# Altium schematic sheet 0246_GPU DECOUPLING_ VC.SchDoc
size 848 x 558 mm
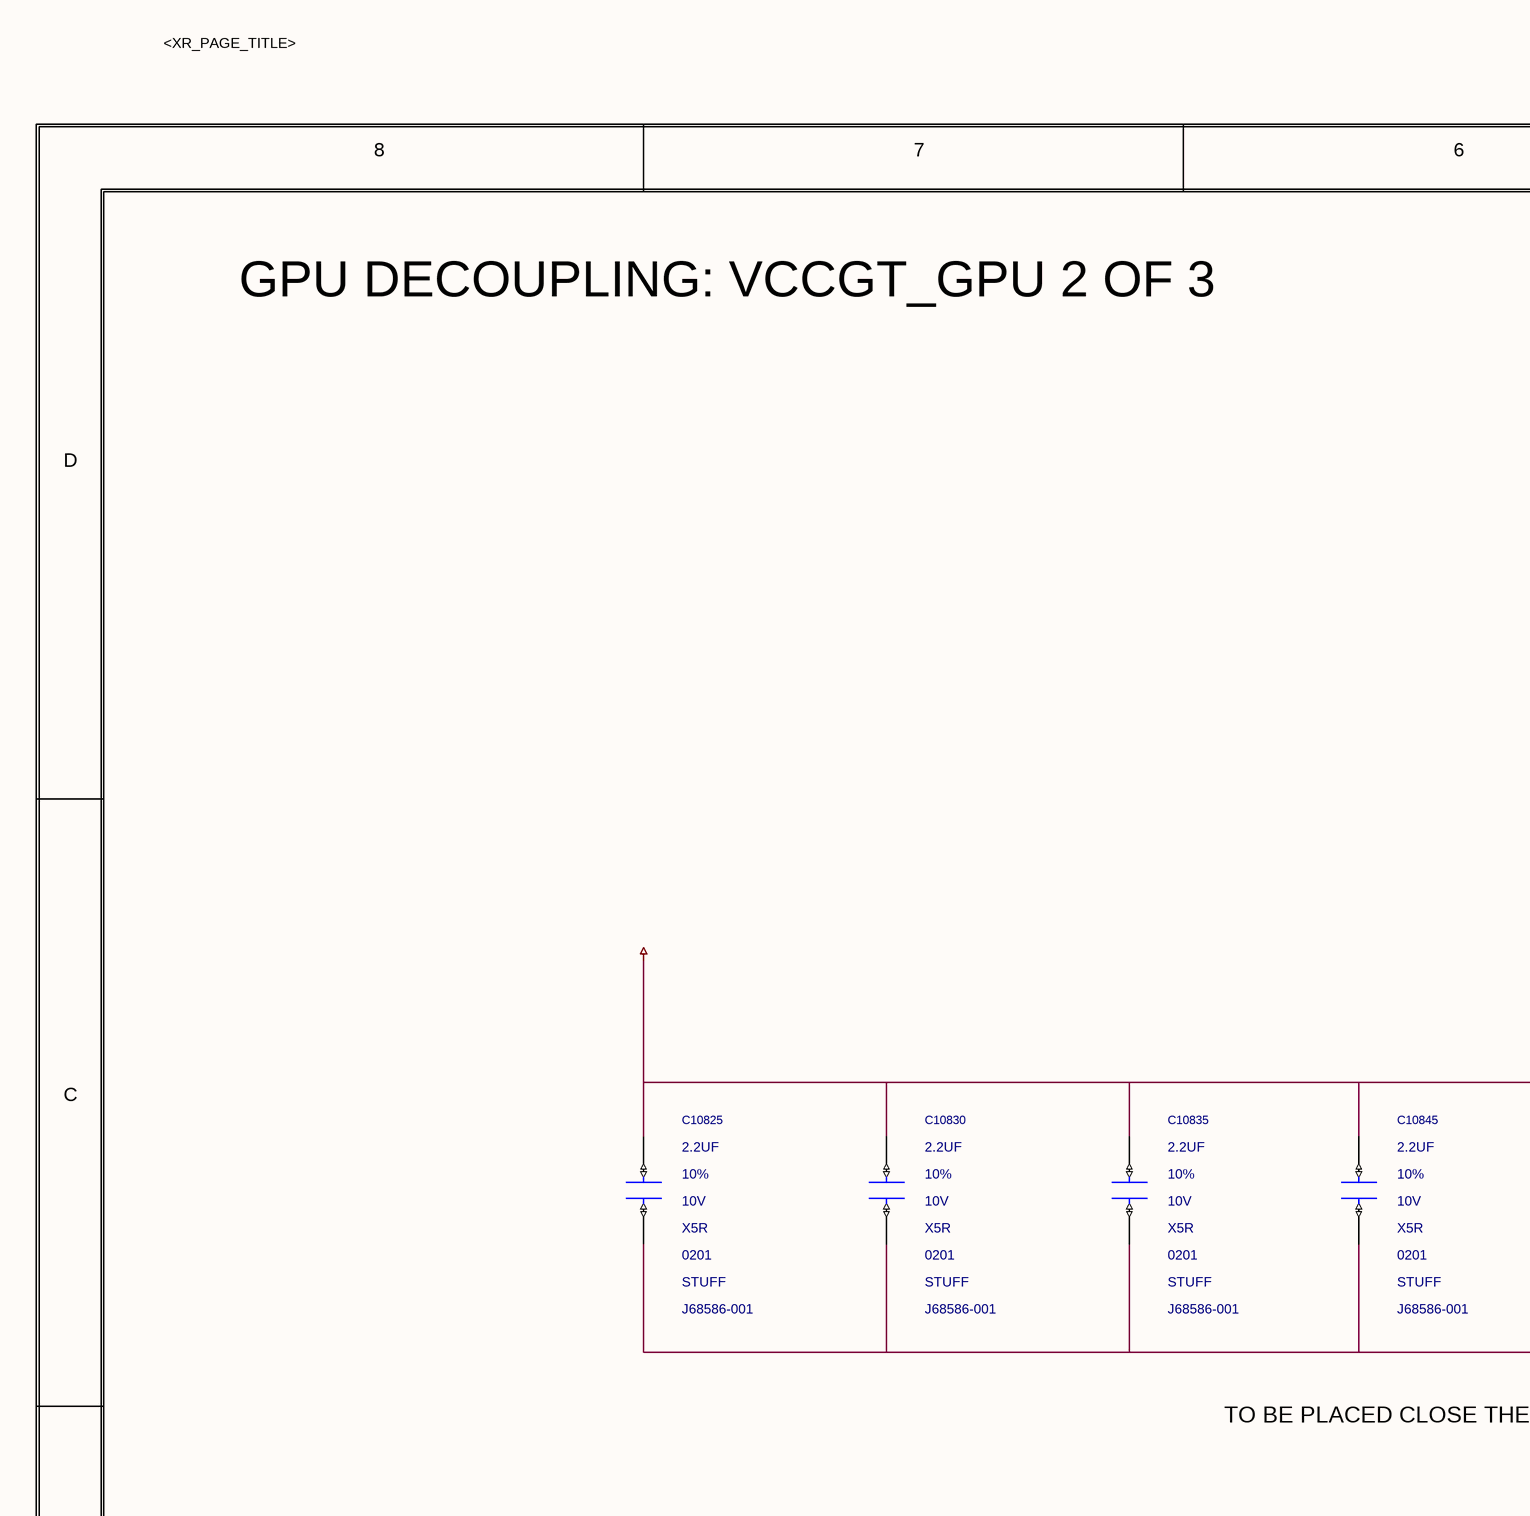
[diagram p0: 0246_GPU DECOUPLING_ VC.SchDoc, top left]
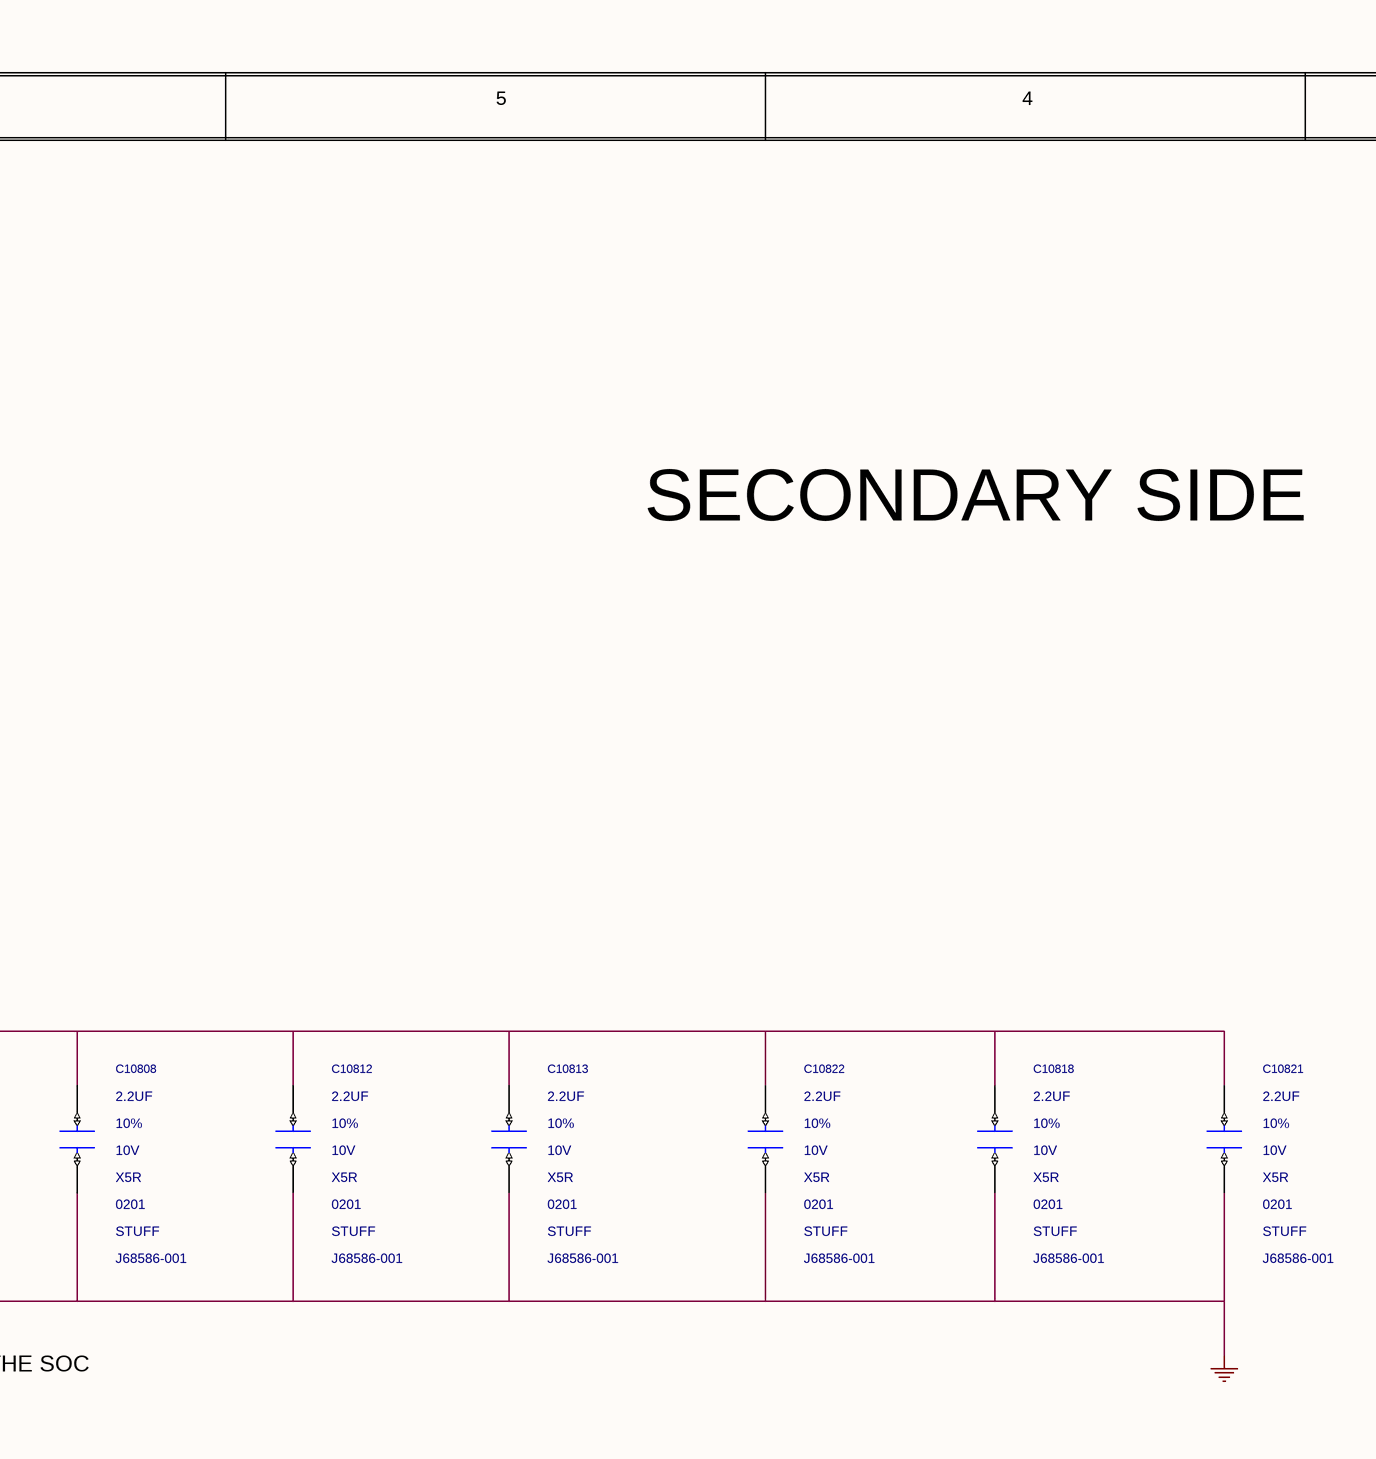
[diagram p1: 0246_GPU DECOUPLING_ VC.SchDoc, top middle]
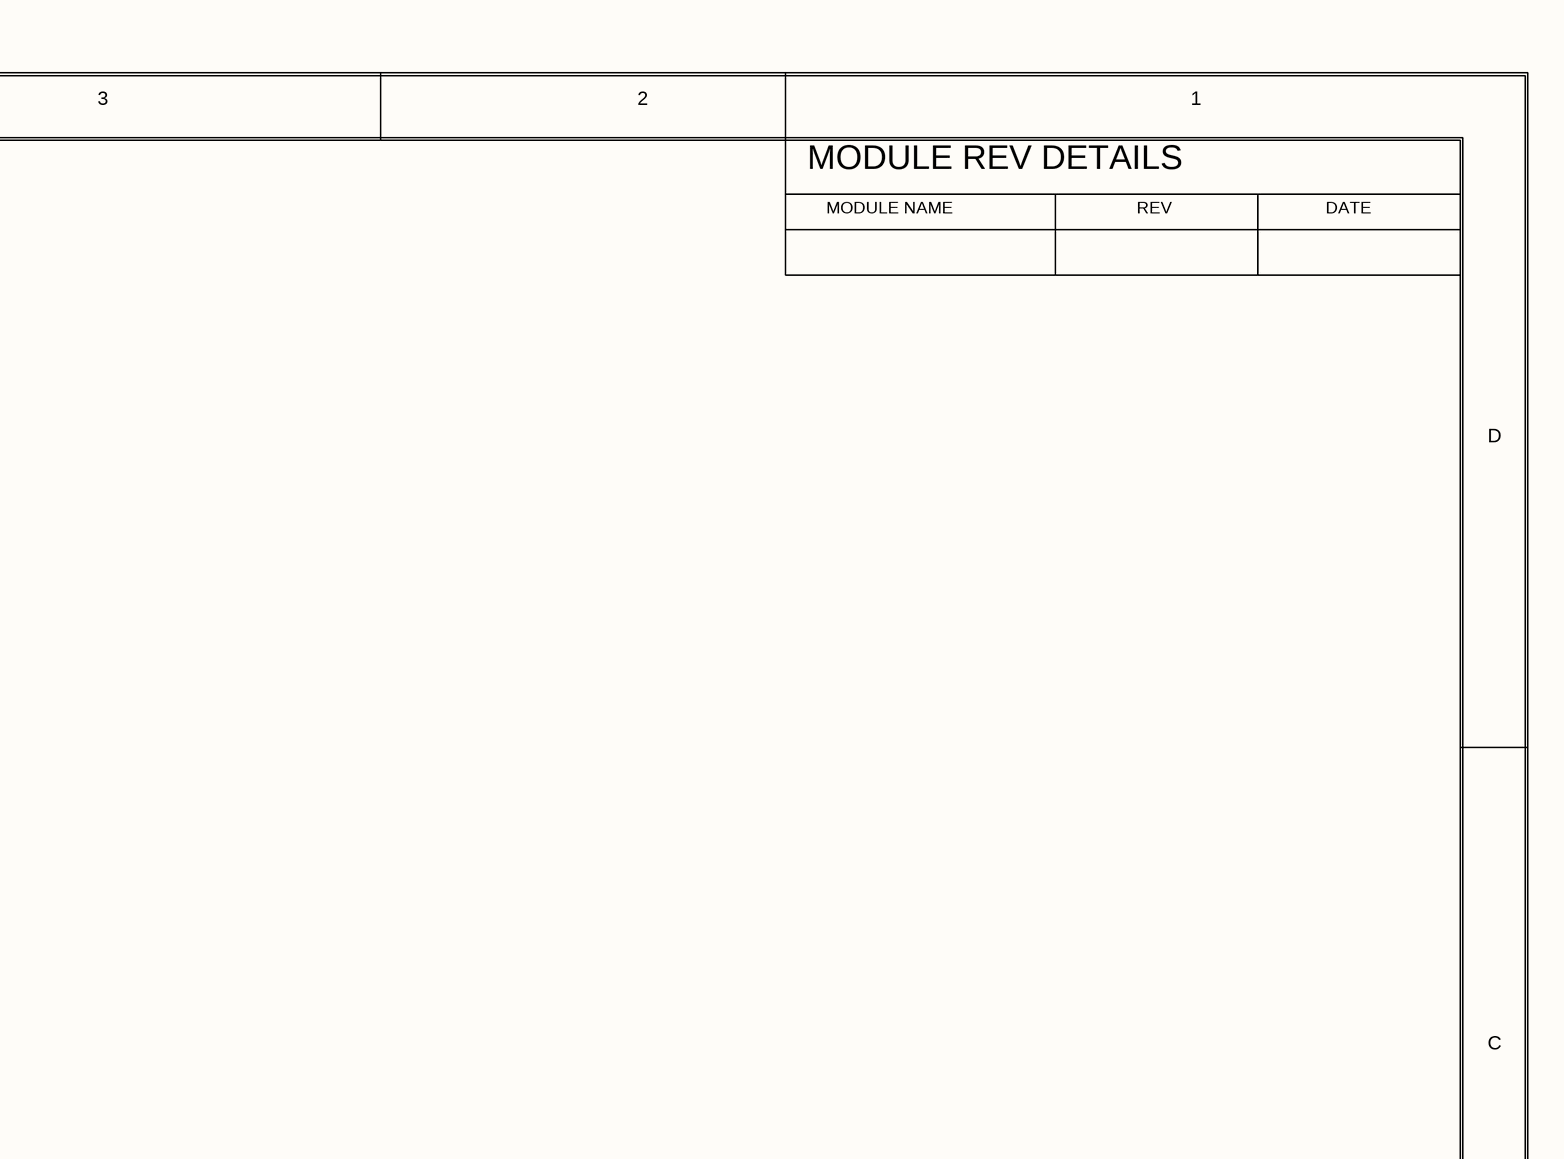
[diagram p2: 0246_GPU DECOUPLING_ VC.SchDoc, top right]
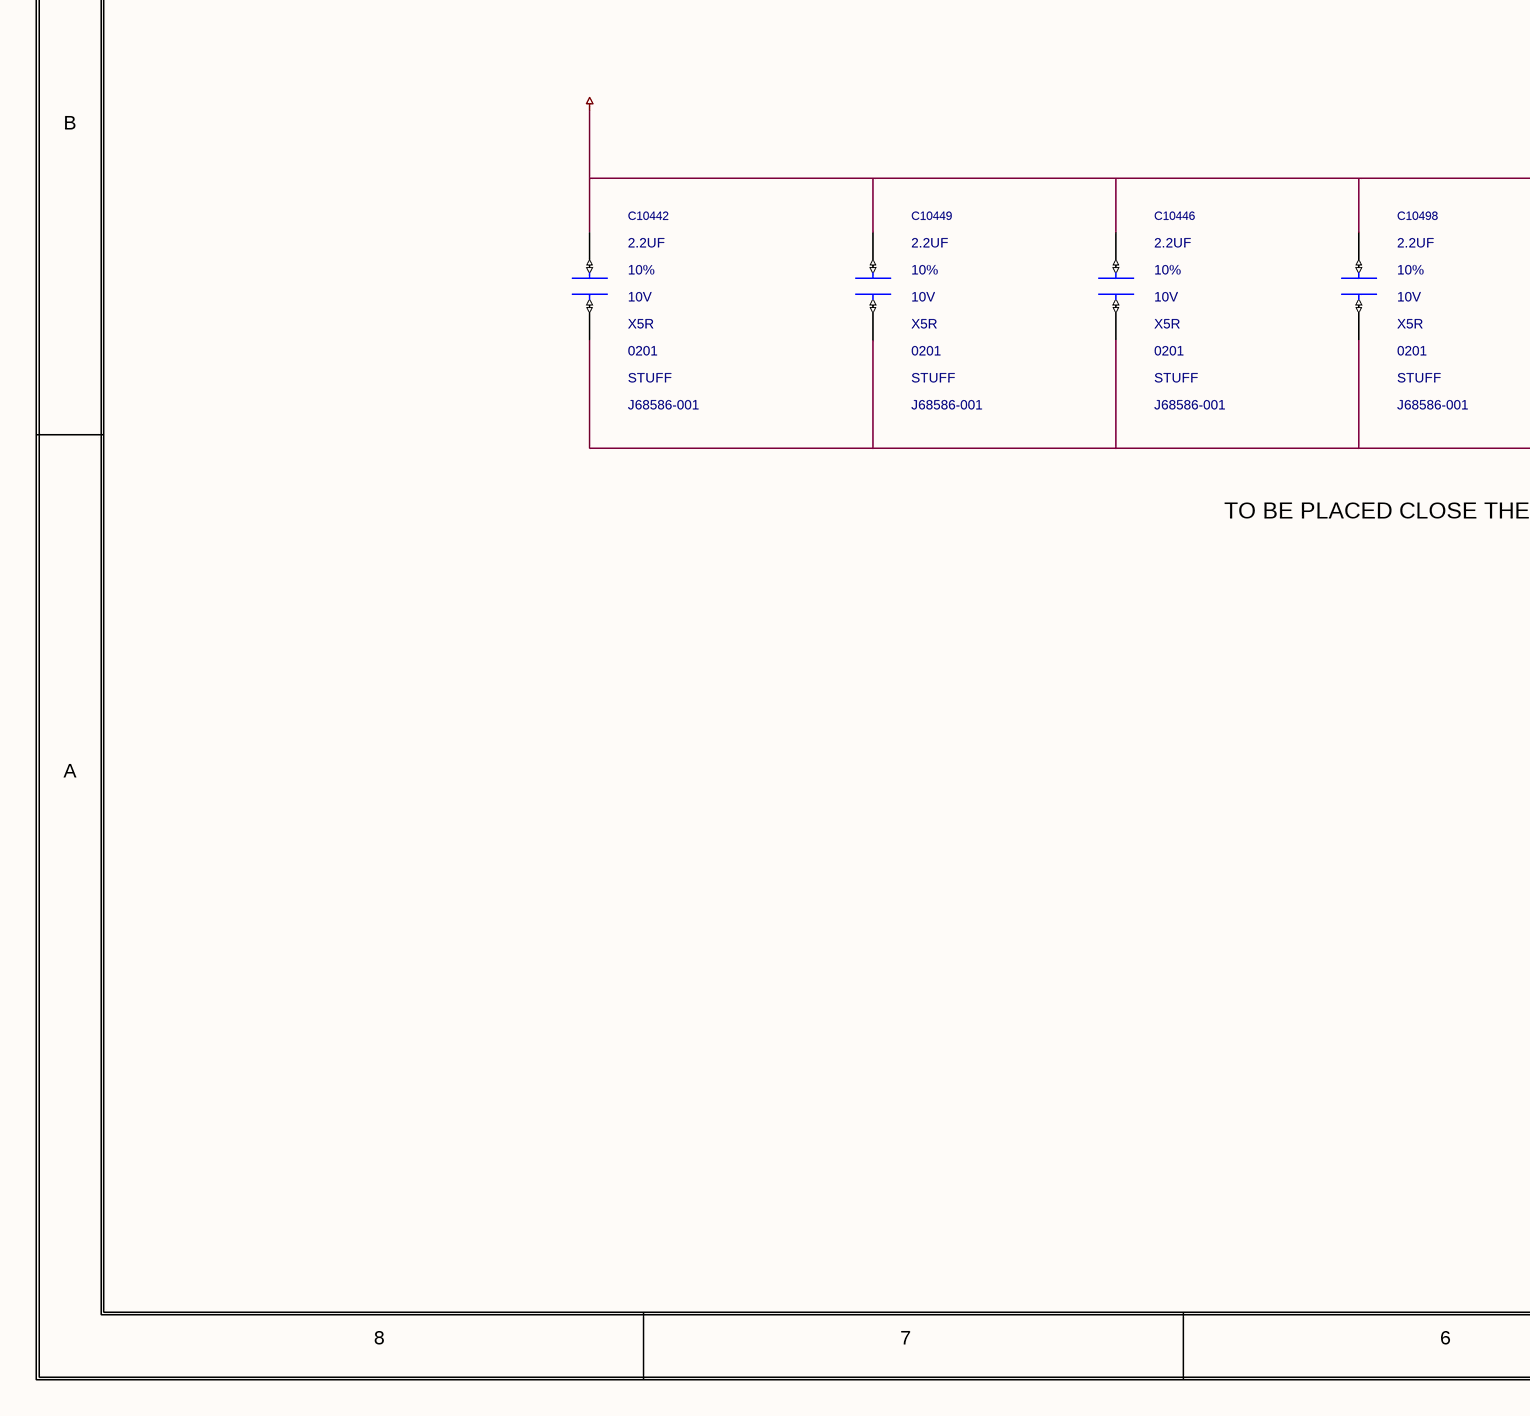
[diagram p3: 0246_GPU DECOUPLING_ VC.SchDoc, bottom left]
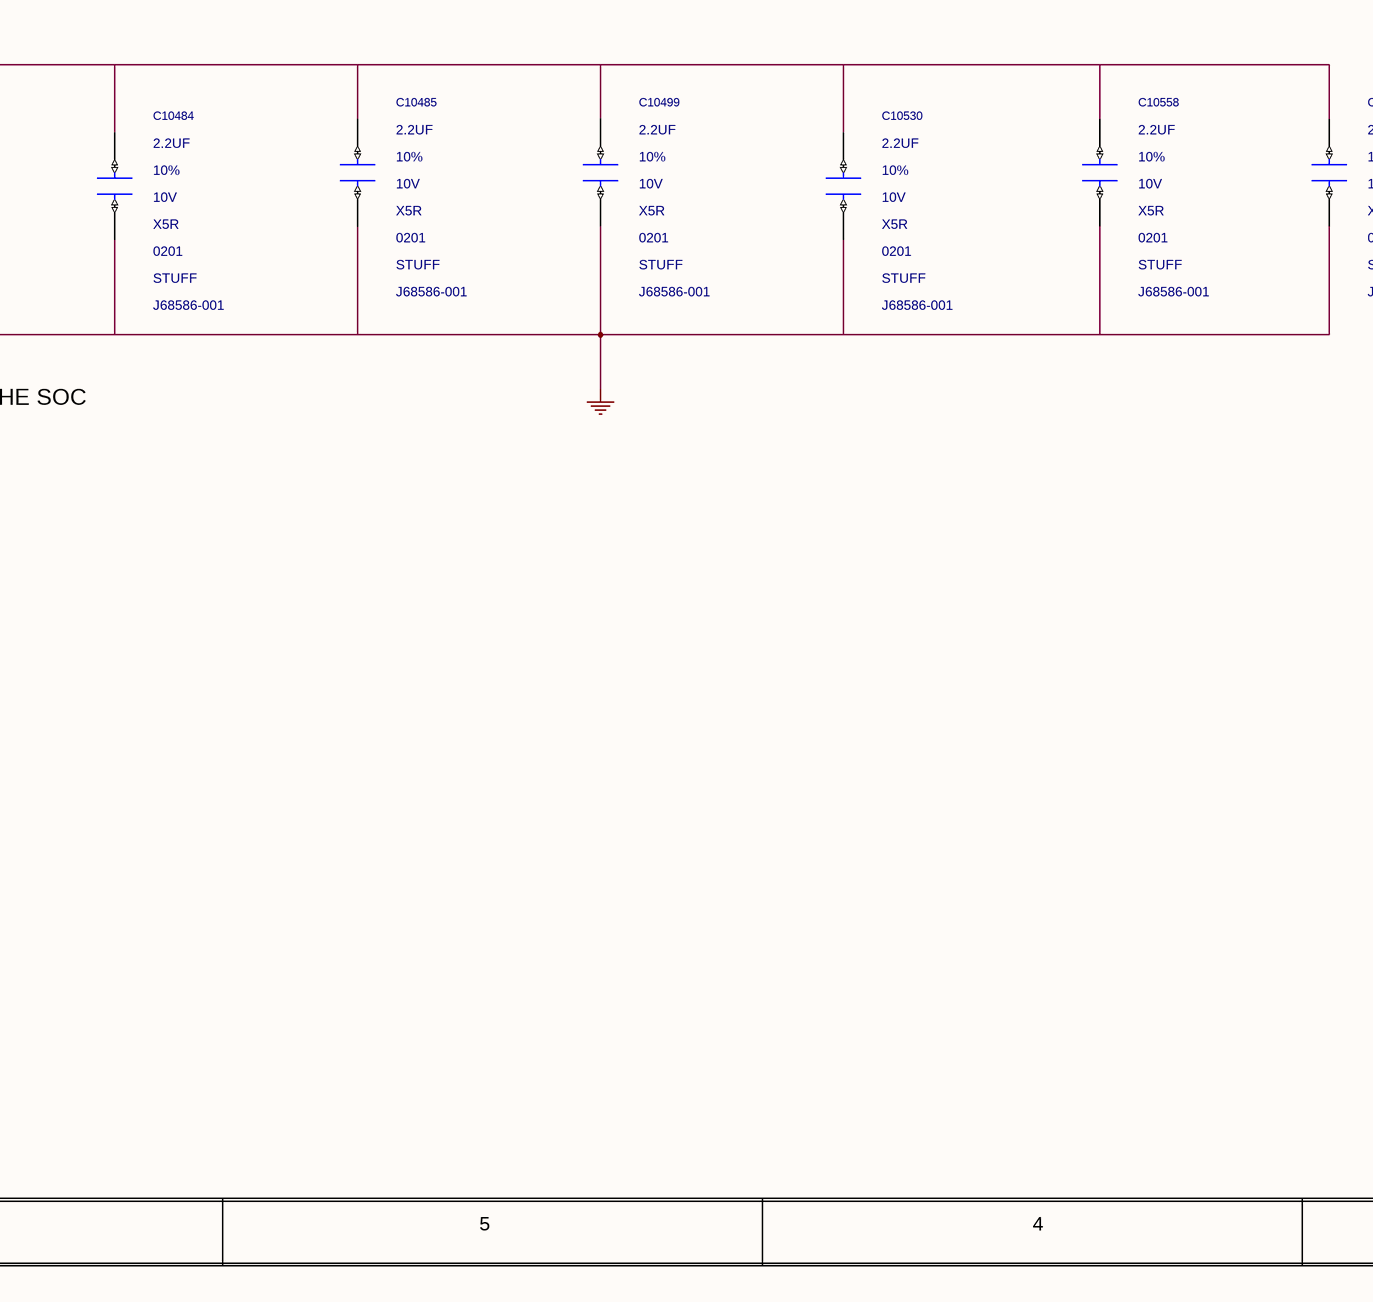
[diagram p4: 0246_GPU DECOUPLING_ VC.SchDoc, bottom middle]
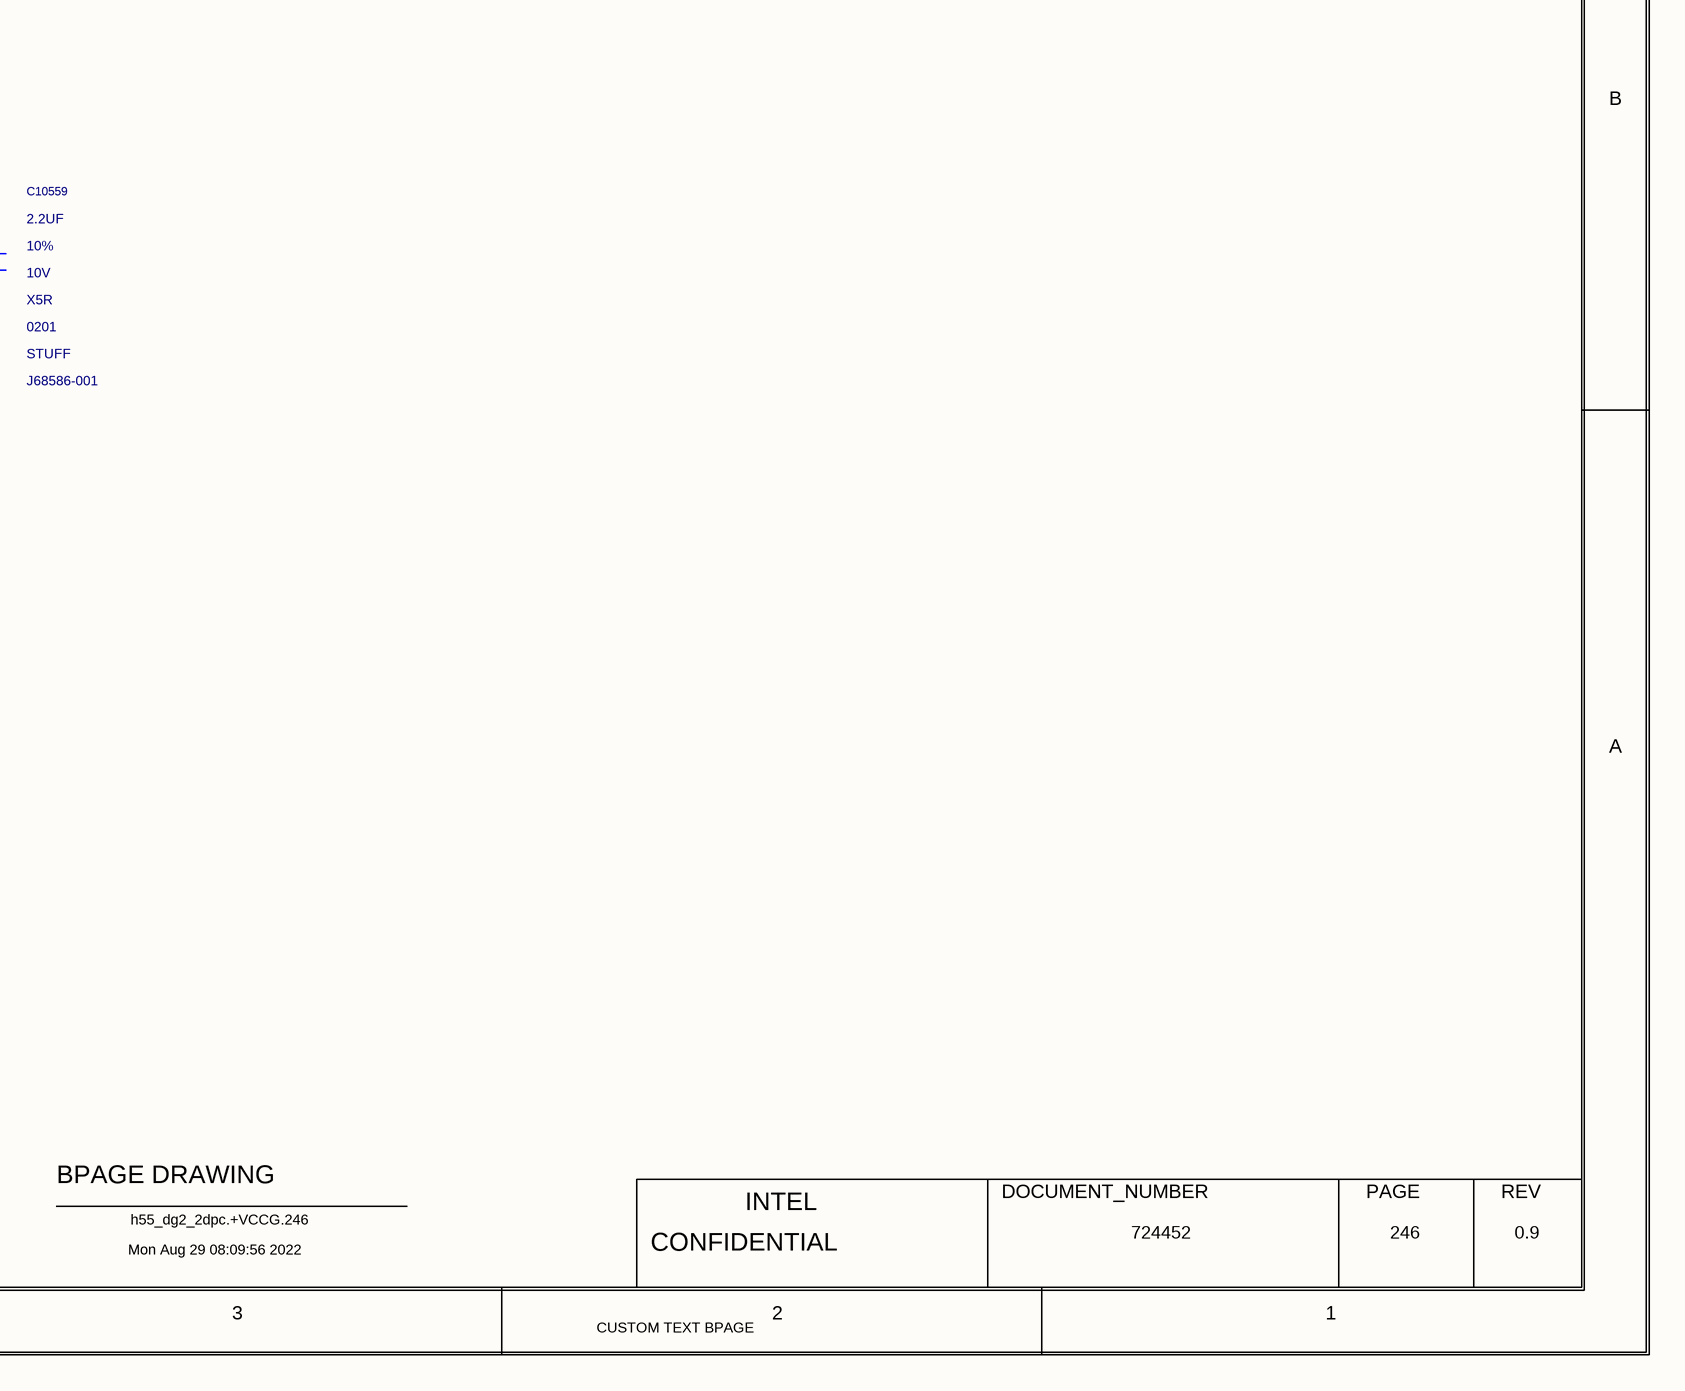
[diagram p5: 0246_GPU DECOUPLING_ VC.SchDoc, bottom right]

## Parts
C10442  2.2UF  BOM_USE: STUFF  MATERIAL: X5R  PACK_TYPE: 0201  PART_NUMBER: J68586-001  TOLERANCE: 10%  VOLTAGE: 10V  [TK0_SM0201_690X390_MC]
C10446  2.2UF  BOM_USE: STUFF  MATERIAL: X5R  PACK_TYPE: 0201  PART_NUMBER: J68586-001  TOLERANCE: 10%  VOLTAGE: 10V  [TK0_SM0201_690X390_MC]
C10449  2.2UF  BOM_USE: STUFF  MATERIAL: X5R  PACK_TYPE: 0201  PART_NUMBER: J68586-001  TOLERANCE: 10%  VOLTAGE: 10V  [TK0_SM0201_690X390_MC]
C10484  2.2UF  BOM_USE: STUFF  MATERIAL: X5R  PACK_TYPE: 0201  PART_NUMBER: J68586-001  TOLERANCE: 10%  VOLTAGE: 10V  [TK0_SM0201_690X390_MC]
C10485  2.2UF  BOM_USE: STUFF  MATERIAL: X5R  PACK_TYPE: 0201  PART_NUMBER: J68586-001  TOLERANCE: 10%  VOLTAGE: 10V  [TK0_SM0201_690X390_MC]
C10498  2.2UF  BOM_USE: STUFF  MATERIAL: X5R  PACK_TYPE: 0201  PART_NUMBER: J68586-001  TOLERANCE: 10%  VOLTAGE: 10V  [TK0_SM0201_690X390_MC]
C10499  2.2UF  BOM_USE: STUFF  MATERIAL: X5R  PACK_TYPE: 0201  PART_NUMBER: J68586-001  TOLERANCE: 10%  VOLTAGE: 10V  [TK0_SM0201_690X390_MC]
C10530  2.2UF  BOM_USE: STUFF  MATERIAL: X5R  PACK_TYPE: 0201  PART_NUMBER: J68586-001  TOLERANCE: 10%  VOLTAGE: 10V  [TK0_SM0201_690X390_MC]
C10558  2.2UF  BOM_USE: STUFF  MATERIAL: X5R  PACK_TYPE: 0201  PART_NUMBER: J68586-001  TOLERANCE: 10%  VOLTAGE: 10V  [TK0_SM0201_690X390_MC]
C10559  2.2UF  BOM_USE: STUFF  MATERIAL: X5R  PACK_TYPE: 0201  PART_NUMBER: J68586-001  TOLERANCE: 10%  VOLTAGE: 10V  [TK0_SM0201_690X390_MC]
C10808  2.2UF  BOM_USE: STUFF  MATERIAL: X5R  PACK_TYPE: 0201  PART_NUMBER: J68586-001  TOLERANCE: 10%  VOLTAGE: 10V  [TK0_SM0201_690X390_MC]
C10812  2.2UF  BOM_USE: STUFF  MATERIAL: X5R  PACK_TYPE: 0201  PART_NUMBER: J68586-001  TOLERANCE: 10%  VOLTAGE: 10V  [TK0_SM0201_690X390_MC]
C10813  2.2UF  BOM_USE: STUFF  MATERIAL: X5R  PACK_TYPE: 0201  PART_NUMBER: J68586-001  TOLERANCE: 10%  VOLTAGE: 10V  [TK0_SM0201_690X390_MC]
C10818  2.2UF  BOM_USE: STUFF  MATERIAL: X5R  PACK_TYPE: 0201  PART_NUMBER: J68586-001  TOLERANCE: 10%  VOLTAGE: 10V  [TK0_SM0201_690X390_MC]
C10821  2.2UF  BOM_USE: STUFF  MATERIAL: X5R  PACK_TYPE: 0201  PART_NUMBER: J68586-001  TOLERANCE: 10%  VOLTAGE: 10V  [TK0_SM0201_690X390_MC]
C10822  2.2UF  BOM_USE: STUFF  MATERIAL: X5R  PACK_TYPE: 0201  PART_NUMBER: J68586-001  TOLERANCE: 10%  VOLTAGE: 10V  [TK0_SM0201_690X390_MC]
C10825  2.2UF  BOM_USE: STUFF  MATERIAL: X5R  PACK_TYPE: 0201  PART_NUMBER: J68586-001  TOLERANCE: 10%  VOLTAGE: 10V  [TK0_SM0201_690X390_MC]
C10830  2.2UF  BOM_USE: STUFF  MATERIAL: X5R  PACK_TYPE: 0201  PART_NUMBER: J68586-001  TOLERANCE: 10%  VOLTAGE: 10V  [TK0_SM0201_690X390_MC]
C10835  2.2UF  BOM_USE: STUFF  MATERIAL: X5R  PACK_TYPE: 0201  PART_NUMBER: J68586-001  TOLERANCE: 10%  VOLTAGE: 10V  [TK0_SM0201_690X390_MC]
C10845  2.2UF  BOM_USE: STUFF  MATERIAL: X5R  PACK_TYPE: 0201  PART_NUMBER: J68586-001  TOLERANCE: 10%  VOLTAGE: 10V  [TK0_SM0201_690X390_MC]

## Nets
+VCCGT_GPU: C10442.1(A) C10446.1(A) C10449.1(A) C10484.1(A) C10485.1(A) C10498.1(A) C10499.1(A) C10530.1(A) C10558.1(A) C10559.1(A) C10808.1(A) C10812.1(A) C10813.1(A) C10818.1(A) C10821.1(A) C10822.1(A) C10825.1(A) C10830.1(A) C10835.1(A) C10845.1(A)
GND: C10442.2(B) C10446.2(B) C10449.2(B) C10484.2(B) C10485.2(B) C10498.2(B) C10499.2(B) C10530.2(B) C10558.2(B) C10559.2(B) C10808.2(B) C10812.2(B) C10813.2(B) C10818.2(B) C10821.2(B) C10822.2(B) C10825.2(B) C10830.2(B) C10835.2(B) C10845.2(B)

## Notes on the sheet
- <XR_PAGE_TITLE>
- 8
- 7
- 6
- 5
- 4
- 3
- 2
- 1
- MODULE REV DETAILS
- GPU DECOUPLING: VCCGT_GPU 2 OF 3
- MODULE NAME
- REV
- DATE
- D
- SECONDARY SIDE
- C
- TO BE PLACED CLOSE THE SOC
- B
- A
- BPAGE DRAWING
- INTEL
- DOCUMENT_NUMBER
- PAGE
- Mon Aug 29 08:09:56 2022
- h55_dg2_2dpc.+VCCG.246
- CONFIDENTIAL
- 724452
- 246
- 0.9
- CUSTOM TEXT BPAGE

## Library data of the parts
C10442 = CAP_2: CDS_PHYS_PART_NAME: CAP_2_0201-J68586-001,X5R,2.2UF,10V,10%,TK0,GENERIC; CDS_LMAN_SYM_OUTLINE: -50,50,50,-50; FP_TECH: TK0; IP: GENERIC; ROOM: NONE; OriginalSymbolOrigin: (-50,25); XY: (-1750,800); VER: 1; ROT: 0; PHYS_PAGE: 246; LOCATION: C10442; DRAWING: @RVP1_ADL_SB_ADP_S_DDR5_SODIMM_2DPC_LIB.H55_DG2_2DPC(SCH_1):PAGE417; CDS_LIB: discrete_2; VARIANT: ?; PCB Footprint: TK0_SM0201_690X390_MC; CHIPS_PART_NAME: CAP_2; CDS_PART_NAME: CAP_2_0201-J68586-001,X5R,2.2UF,10V,10%,TK0,GENERIC; CDS_LOCATION: C10442
C10446 = CAP_2: CDS_PHYS_PART_NAME: CAP_2_0201-J68586-001,X5R,2.2UF,10V,10%,TK0,GENERIC; CDS_LMAN_SYM_OUTLINE: -50,50,50,-50; FP_TECH: TK0; IP: GENERIC; ROOM: NONE; OriginalSymbolOrigin: (-50,25); XY: (-775,800); VER: 1; ROT: 0; PHYS_PAGE: 246; LOCATION: C10446; DRAWING: @RVP1_ADL_SB_ADP_S_DDR5_SODIMM_2DPC_LIB.H55_DG2_2DPC(SCH_1):PAGE417; CDS_LIB: discrete_2; VARIANT: ?; PCB Footprint: TK0_SM0201_690X390_MC; CHIPS_PART_NAME: CAP_2; CDS_PART_NAME: CAP_2_0201-J68586-001,X5R,2.2UF,10V,10%,TK0,GENERIC; CDS_LOCATION: C10446
C10449 = CAP_2: CDS_PHYS_PART_NAME: CAP_2_0201-J68586-001,X5R,2.2UF,10V,10%,TK0,GENERIC; CDS_LMAN_SYM_OUTLINE: -50,50,50,-50; FP_TECH: TK0; IP: GENERIC; ROOM: NONE; OriginalSymbolOrigin: (-50,25); XY: (-1225,800); VER: 1; ROT: 0; PHYS_PAGE: 246; LOCATION: C10449; DRAWING: @RVP1_ADL_SB_ADP_S_DDR5_SODIMM_2DPC_LIB.H55_DG2_2DPC(SCH_1):PAGE417; CDS_LIB: discrete_2; VARIANT: ?; PCB Footprint: TK0_SM0201_690X390_MC; CHIPS_PART_NAME: CAP_2; CDS_PART_NAME: CAP_2_0201-J68586-001,X5R,2.2UF,10V,10%,TK0,GENERIC; CDS_LOCATION: C10449
C10484 = CAP_2: CDS_PHYS_PART_NAME: CAP_2_0201-J68586-001,X5R,2.2UF,10V,10%,TK0,GENERIC; CDS_LMAN_SYM_OUTLINE: -50,50,50,-50; FP_TECH: TK0; IP: GENERIC; ROOM: NONE; OriginalSymbolOrigin: (-50,25); XY: (150,775); VER: 1; ROT: 0; PHYS_PAGE: 246; LOCATION: C10484; DRAWING: @RVP1_ADL_SB_ADP_S_DDR5_SODIMM_2DPC_LIB.H55_DG2_2DPC(SCH_1):PAGE417; CDS_LIB: discrete_2; VARIANT: ?; PCB Footprint: TK0_SM0201_690X390_MC; CHIPS_PART_NAME: CAP_2; CDS_PART_NAME: CAP_2_0201-J68586-001,X5R,2.2UF,10V,10%,TK0,GENERIC; CDS_LOCATION: C10484
C10485 = CAP_2: CDS_PHYS_PART_NAME: CAP_2_0201-J68586-001,X5R,2.2UF,10V,10%,TK0,GENERIC; CDS_LMAN_SYM_OUTLINE: -50,50,50,-50; FP_TECH: TK0; IP: GENERIC; ROOM: NONE; OriginalSymbolOrigin: (-50,25); XY: (600,800); VER: 1; ROT: 0; PHYS_PAGE: 246; LOCATION: C10485; DRAWING: @RVP1_ADL_SB_ADP_S_DDR5_SODIMM_2DPC_LIB.H55_DG2_2DPC(SCH_1):PAGE417; CDS_LIB: discrete_2; VARIANT: ?; PCB Footprint: TK0_SM0201_690X390_MC; CHIPS_PART_NAME: CAP_2; CDS_PART_NAME: CAP_2_0201-J68586-001,X5R,2.2UF,10V,10%,TK0,GENERIC; CDS_LOCATION: C10485
C10498 = CAP_2: CDS_PHYS_PART_NAME: CAP_2_0201-J68586-001,X5R,2.2UF,10V,10%,TK0,GENERIC; CDS_LMAN_SYM_OUTLINE: -50,50,50,-50; FP_TECH: TK0; IP: GENERIC; ROOM: NONE; OriginalSymbolOrigin: (-50,25); XY: (-325,800); VER: 1; ROT: 0; PHYS_PAGE: 246; LOCATION: C10498; DRAWING: @RVP1_ADL_SB_ADP_S_DDR5_SODIMM_2DPC_LIB.H55_DG2_2DPC(SCH_1):PAGE417; CDS_LIB: discrete_2; VARIANT: ?; PCB Footprint: TK0_SM0201_690X390_MC; CHIPS_PART_NAME: CAP_2; CDS_PART_NAME: CAP_2_0201-J68586-001,X5R,2.2UF,10V,10%,TK0,GENERIC; CDS_LOCATION: C10498
C10499 = CAP_2: CDS_PHYS_PART_NAME: CAP_2_0201-J68586-001,X5R,2.2UF,10V,10%,TK0,GENERIC; CDS_LMAN_SYM_OUTLINE: -50,50,50,-50; FP_TECH: TK0; IP: GENERIC; ROOM: NONE; OriginalSymbolOrigin: (-50,25); XY: (1050,800); VER: 1; ROT: 0; PHYS_PAGE: 246; LOCATION: C10499; DRAWING: @RVP1_ADL_SB_ADP_S_DDR5_SODIMM_2DPC_LIB.H55_DG2_2DPC(SCH_1):PAGE417; CDS_LIB: discrete_2; VARIANT: ?; PCB Footprint: TK0_SM0201_690X390_MC; CHIPS_PART_NAME: CAP_2; CDS_PART_NAME: CAP_2_0201-J68586-001,X5R,2.2UF,10V,10%,TK0,GENERIC; CDS_LOCATION: C10499
C10530 = CAP_2: CDS_PHYS_PART_NAME: CAP_2_0201-J68586-001,X5R,2.2UF,10V,10%,TK0,GENERIC; CDS_LMAN_SYM_OUTLINE: -50,50,50,-50; FP_TECH: TK0; IP: GENERIC; ROOM: NONE; OriginalSymbolOrigin: (-50,25); XY: (1500,775); VER: 1; ROT: 0; PHYS_PAGE: 246; LOCATION: C10530; DRAWING: @RVP1_ADL_SB_ADP_S_DDR5_SODIMM_2DPC_LIB.H55_DG2_2DPC(SCH_1):PAGE417; CDS_LIB: discrete_2; VARIANT: ?; PCB Footprint: TK0_SM0201_690X390_MC; CHIPS_PART_NAME: CAP_2; CDS_PART_NAME: CAP_2_0201-J68586-001,X5R,2.2UF,10V,10%,TK0,GENERIC; CDS_LOCATION: C10530
C10558 = CAP_2: CDS_PHYS_PART_NAME: CAP_2_0201-J68586-001,X5R,2.2UF,10V,10%,TK0,GENERIC; CDS_LMAN_SYM_OUTLINE: -50,50,50,-50; FP_TECH: TK0; IP: GENERIC; ROOM: NONE; OriginalSymbolOrigin: (-50,25); XY: (1975,800); VER: 1; ROT: 0; PHYS_PAGE: 246; LOCATION: C10558; DRAWING: @RVP1_ADL_SB_ADP_S_DDR5_SODIMM_2DPC_LIB.H55_DG2_2DPC(SCH_1):PAGE417; CDS_LIB: discrete_2; VARIANT: ?; PCB Footprint: TK0_SM0201_690X390_MC; CHIPS_PART_NAME: CAP_2; CDS_PART_NAME: CAP_2_0201-J68586-001,X5R,2.2UF,10V,10%,TK0,GENERIC; CDS_LOCATION: C10558
C10559 = CAP_2: CDS_PHYS_PART_NAME: CAP_2_0201-J68586-001,X5R,2.2UF,10V,10%,TK0,GENERIC; CDS_LMAN_SYM_OUTLINE: -50,50,50,-50; FP_TECH: TK0; IP: GENERIC; ROOM: NONE; OriginalSymbolOrigin: (-50,25); XY: (2400,800); VER: 1; ROT: 0; PHYS_PAGE: 246; LOCATION: C10559; DRAWING: @RVP1_ADL_SB_ADP_S_DDR5_SODIMM_2DPC_LIB.H55_DG2_2DPC(SCH_1):PAGE417; CDS_LIB: discrete_2; VARIANT: ?; PCB Footprint: TK0_SM0201_690X390_MC; CHIPS_PART_NAME: CAP_2; CDS_PART_NAME: CAP_2_0201-J68586-001,X5R,2.2UF,10V,10%,TK0,GENERIC; CDS_LOCATION: C10559
C10808 = CAP_2: CDS_PHYS_PART_NAME: CAP_2_0201-J68586-001,X5R,2.2UF,10V,10%,TK0,GENERIC; CDS_LMAN_SYM_OUTLINE: -50,50,50,-50; FP_TECH: TK0; IP: GENERIC; ROOM: NONE; OriginalSymbolOrigin: (-50,25); XY: (75,2050); VER: 1; ROT: 0; PHYS_PAGE: 246; LOCATION: C10808; DRAWING: @RVP1_ADL_SB_ADP_S_DDR5_SODIMM_2DPC_LIB.H55_DG2_2DPC(SCH_1):PAGE417; CDS_LIB: discrete_2; VARIANT: ?; PCB Footprint: TK0_SM0201_690X390_MC; CHIPS_PART_NAME: CAP_2; CDS_PART_NAME: CAP_2_0201-J68586-001,X5R,2.2UF,10V,10%,TK0,GENERIC; CDS_LOCATION: C10808
C10812 = CAP_2: CDS_PHYS_PART_NAME: CAP_2_0201-J68586-001,X5R,2.2UF,10V,10%,TK0,GENERIC; CDS_LMAN_SYM_OUTLINE: -50,50,50,-50; FP_TECH: TK0; IP: GENERIC; ROOM: NONE; OriginalSymbolOrigin: (-50,25); XY: (475,2050); VER: 1; ROT: 0; PHYS_PAGE: 246; LOCATION: C10812; DRAWING: @RVP1_ADL_SB_ADP_S_DDR5_SODIMM_2DPC_LIB.H55_DG2_2DPC(SCH_1):PAGE417; CDS_LIB: discrete_2; VARIANT: ?; PCB Footprint: TK0_SM0201_690X390_MC; CHIPS_PART_NAME: CAP_2; CDS_PART_NAME: CAP_2_0201-J68586-001,X5R,2.2UF,10V,10%,TK0,GENERIC; CDS_LOCATION: C10812
C10813 = CAP_2: CDS_PHYS_PART_NAME: CAP_2_0201-J68586-001,X5R,2.2UF,10V,10%,TK0,GENERIC; CDS_LMAN_SYM_OUTLINE: -50,50,50,-50; FP_TECH: TK0; IP: GENERIC; ROOM: NONE; OriginalSymbolOrigin: (-50,25); XY: (875,2050); VER: 1; ROT: 0; PHYS_PAGE: 246; LOCATION: C10813; DRAWING: @RVP1_ADL_SB_ADP_S_DDR5_SODIMM_2DPC_LIB.H55_DG2_2DPC(SCH_1):PAGE417; CDS_LIB: discrete_2; VARIANT: ?; PCB Footprint: TK0_SM0201_690X390_MC; CHIPS_PART_NAME: CAP_2; CDS_PART_NAME: CAP_2_0201-J68586-001,X5R,2.2UF,10V,10%,TK0,GENERIC; CDS_LOCATION: C10813
C10818 = CAP_2: CDS_PHYS_PART_NAME: CAP_2_0201-J68586-001,X5R,2.2UF,10V,10%,TK0,GENERIC; CDS_LMAN_SYM_OUTLINE: -50,50,50,-50; FP_TECH: TK0; IP: GENERIC; ROOM: NONE; OriginalSymbolOrigin: (-50,25); XY: (1775,2050); VER: 1; ROT: 0; PHYS_PAGE: 246; LOCATION: C10818; DRAWING: @RVP1_ADL_SB_ADP_S_DDR5_SODIMM_2DPC_LIB.H55_DG2_2DPC(SCH_1):PAGE417; CDS_LIB: discrete_2; VARIANT: ?; PCB Footprint: TK0_SM0201_690X390_MC; CHIPS_PART_NAME: CAP_2; CDS_PART_NAME: CAP_2_0201-J68586-001,X5R,2.2UF,10V,10%,TK0,GENERIC; CDS_LOCATION: C10818
C10821 = CAP_2: CDS_PHYS_PART_NAME: CAP_2_0201-J68586-001,X5R,2.2UF,10V,10%,TK0,GENERIC; CDS_LMAN_SYM_OUTLINE: -50,50,50,-50; FP_TECH: TK0; IP: GENERIC; ROOM: NONE; OriginalSymbolOrigin: (-50,25); XY: (2200,2050); VER: 1; ROT: 0; PHYS_PAGE: 246; LOCATION: C10821; DRAWING: @RVP1_ADL_SB_ADP_S_DDR5_SODIMM_2DPC_LIB.H55_DG2_2DPC(SCH_1):PAGE417; CDS_LIB: discrete_2; VARIANT: ?; PCB Footprint: TK0_SM0201_690X390_MC; CHIPS_PART_NAME: CAP_2; CDS_PART_NAME: CAP_2_0201-J68586-001,X5R,2.2UF,10V,10%,TK0,GENERIC; CDS_LOCATION: C10821
C10822 = CAP_2: CDS_PHYS_PART_NAME: CAP_2_0201-J68586-001,X5R,2.2UF,10V,10%,TK0,GENERIC; CDS_LMAN_SYM_OUTLINE: -50,50,50,-50; FP_TECH: TK0; IP: GENERIC; ROOM: NONE; OriginalSymbolOrigin: (-50,25); XY: (1350,2050); VER: 1; ROT: 0; PHYS_PAGE: 246; LOCATION: C10822; DRAWING: @RVP1_ADL_SB_ADP_S_DDR5_SODIMM_2DPC_LIB.H55_DG2_2DPC(SCH_1):PAGE417; CDS_LIB: discrete_2; VARIANT: ?; PCB Footprint: TK0_SM0201_690X390_MC; CHIPS_PART_NAME: CAP_2; CDS_PART_NAME: CAP_2_0201-J68586-001,X5R,2.2UF,10V,10%,TK0,GENERIC; CDS_LOCATION: C10822
C10825 = CAP_2: CDS_PHYS_PART_NAME: CAP_2_0201-J68586-001,X5R,2.2UF,10V,10%,TK0,GENERIC; CDS_LMAN_SYM_OUTLINE: -50,50,50,-50; FP_TECH: TK0; IP: GENERIC; ROOM: NONE; OriginalSymbolOrigin: (-50,25); XY: (-1650,2050); VER: 1; ROT: 0; PHYS_PAGE: 246; LOCATION: C10825; DRAWING: @RVP1_ADL_SB_ADP_S_DDR5_SODIMM_2DPC_LIB.H55_DG2_2DPC(SCH_1):PAGE417; CDS_LIB: discrete_2; VARIANT: ?; PCB Footprint: TK0_SM0201_690X390_MC; CHIPS_PART_NAME: CAP_2; CDS_PART_NAME: CAP_2_0201-J68586-001,X5R,2.2UF,10V,10%,TK0,GENERIC; CDS_LOCATION: C10825
C10830 = CAP_2: CDS_PHYS_PART_NAME: CAP_2_0201-J68586-001,X5R,2.2UF,10V,10%,TK0,GENERIC; CDS_LMAN_SYM_OUTLINE: -50,50,50,-50; FP_TECH: TK0; IP: GENERIC; ROOM: NONE; OriginalSymbolOrigin: (-50,25); XY: (-1200,2050); VER: 1; ROT: 0; PHYS_PAGE: 246; LOCATION: C10830; DRAWING: @RVP1_ADL_SB_ADP_S_DDR5_SODIMM_2DPC_LIB.H55_DG2_2DPC(SCH_1):PAGE417; CDS_LIB: discrete_2; VARIANT: ?; PCB Footprint: TK0_SM0201_690X390_MC; CHIPS_PART_NAME: CAP_2; CDS_PART_NAME: CAP_2_0201-J68586-001,X5R,2.2UF,10V,10%,TK0,GENERIC; CDS_LOCATION: C10830
C10835 = CAP_2: CDS_PHYS_PART_NAME: CAP_2_0201-J68586-001,X5R,2.2UF,10V,10%,TK0,GENERIC; CDS_LMAN_SYM_OUTLINE: -50,50,50,-50; FP_TECH: TK0; IP: GENERIC; ROOM: NONE; OriginalSymbolOrigin: (-50,25); XY: (-750,2050); VER: 1; ROT: 0; PHYS_PAGE: 246; LOCATION: C10835; DRAWING: @RVP1_ADL_SB_ADP_S_DDR5_SODIMM_2DPC_LIB.H55_DG2_2DPC(SCH_1):PAGE417; CDS_LIB: discrete_2; VARIANT: ?; PCB Footprint: TK0_SM0201_690X390_MC; CHIPS_PART_NAME: CAP_2; CDS_PART_NAME: CAP_2_0201-J68586-001,X5R,2.2UF,10V,10%,TK0,GENERIC; CDS_LOCATION: C10835
C10845 = CAP_2: CDS_PHYS_PART_NAME: CAP_2_0201-J68586-001,X5R,2.2UF,10V,10%,TK0,GENERIC; CDS_LMAN_SYM_OUTLINE: -50,50,50,-50; FP_TECH: TK0; IP: GENERIC; ROOM: NONE; OriginalSymbolOrigin: (-50,25); XY: (-325,2050); VER: 1; ROT: 0; PHYS_PAGE: 246; LOCATION: C10845; DRAWING: @RVP1_ADL_SB_ADP_S_DDR5_SODIMM_2DPC_LIB.H55_DG2_2DPC(SCH_1):PAGE417; CDS_LIB: discrete_2; VARIANT: ?; PCB Footprint: TK0_SM0201_690X390_MC; CHIPS_PART_NAME: CAP_2; CDS_PART_NAME: CAP_2_0201-J68586-001,X5R,2.2UF,10V,10%,TK0,GENERIC; CDS_LOCATION: C10845